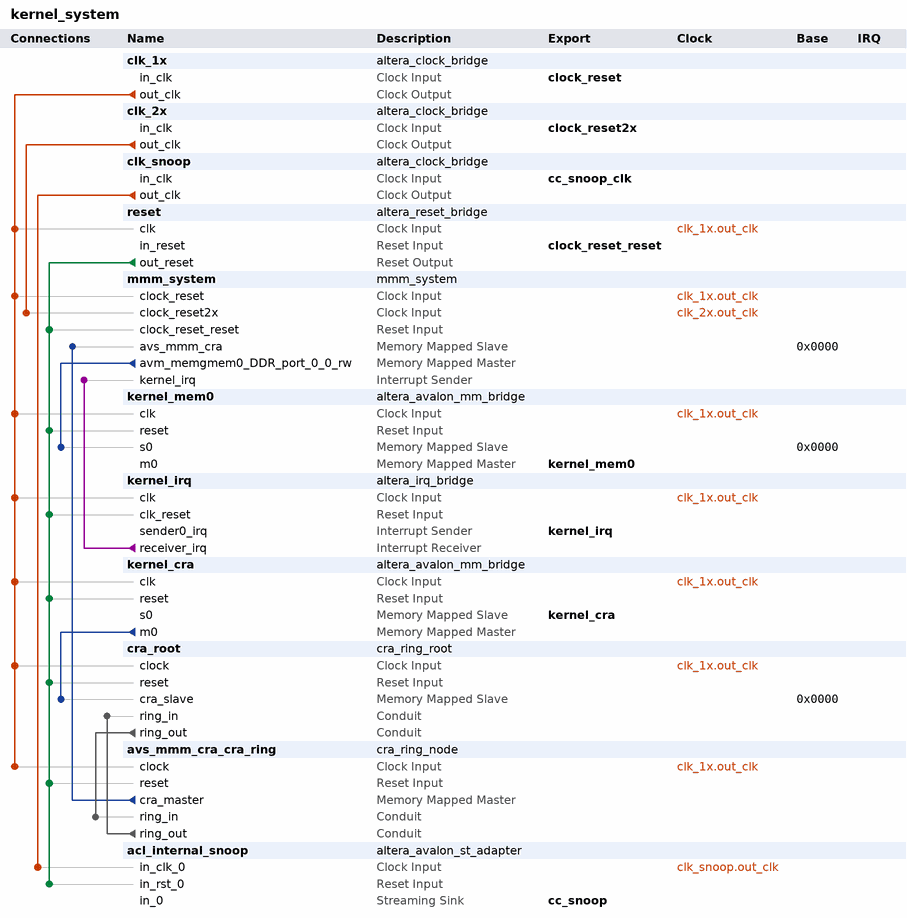
[diagram p0: system contents]
# Platform Designer (Qsys) system kernel_system, Arria 10 10AX115S2F45I1SG
# Parameters at their usual value, and those the tool derives, are not listed.
package require -exact qsys 1.0
create_system kernel_system
set_project_property DEVICE_FAMILY {Arria 10}
set_project_property DEVICE 10AX115S2F45I1SG

add_component clk_1x ip/kernel_system/kernel_system_clk_1x.ip altera_clock_bridge clk_1x 17.1

add_component clk_2x ip/kernel_system/kernel_system_clk_2x.ip altera_clock_bridge clk_2x 17.1

add_component clk_snoop ip/kernel_system/kernel_system_clk_snoop.ip altera_clock_bridge clk_snoop 17.1

add_component reset ip/kernel_system/kernel_system_reset.ip altera_reset_bridge reset 17.1

add_component mmm_system ip/kernel_system/kernel_system_mmm_system.ip mmm_system mmm_system 14.0

add_component kernel_mem0 ip/kernel_system/kernel_system_kernel_mem0.ip altera_avalon_mm_bridge kernel_mem0 17.1

add_component kernel_irq ip/kernel_system/kernel_system_kernel_irq.ip altera_irq_bridge kernel_irq 17.1

add_component kernel_cra ip/kernel_system/kernel_system_kernel_cra.ip altera_avalon_mm_bridge kernel_cra 17.1

add_component cra_root ip/kernel_system/kernel_system_cra_root.ip cra_ring_root cra_root 1.0

add_component avs_mmm_cra_cra_ring ip/kernel_system/kernel_system_avs_mmm_cra_cra_ring.ip cra_ring_node avs_mmm_cra_cra_ring 1.0

add_component acl_internal_snoop ip/kernel_system/kernel_system_acl_internal_snoop.ip altera_avalon_st_adapter acl_internal_snoop 17.1

# connections
add_connection clk_1x.out_clk avs_mmm_cra_cra_ring.clock clock
add_connection clk_1x.out_clk cra_root.clock clock
add_connection clk_1x.out_clk kernel_cra.clk clock
add_connection clk_1x.out_clk kernel_irq.clk clock
add_connection clk_1x.out_clk kernel_mem0.clk clock
add_connection clk_1x.out_clk mmm_system.clock_reset clock
add_connection clk_1x.out_clk reset.clk clock
add_connection clk_2x.out_clk mmm_system.clock_reset2x clock
add_connection clk_snoop.out_clk acl_internal_snoop.in_clk_0 clock
add_connection reset.out_reset acl_internal_snoop.in_rst_0 reset
add_connection reset.out_reset avs_mmm_cra_cra_ring.reset reset
add_connection reset.out_reset cra_root.reset reset
add_connection reset.out_reset kernel_cra.reset reset
add_connection reset.out_reset kernel_irq.clk_reset reset
add_connection reset.out_reset kernel_mem0.reset reset
add_connection reset.out_reset mmm_system.clock_reset_reset reset
add_connection avs_mmm_cra_cra_ring.cra_master mmm_system.avs_mmm_cra avalon
set_connection_parameter_value avs_mmm_cra_cra_ring.cra_master/mmm_system.avs_mmm_cra baseAddress 0x0000
add_connection kernel_cra.m0 cra_root.cra_slave avalon
set_connection_parameter_value kernel_cra.m0/cra_root.cra_slave baseAddress 0x0000
add_connection mmm_system.avm_memgmem0_DDR_port_0_0_rw kernel_mem0.s0 avalon
set_connection_parameter_value mmm_system.avm_memgmem0_DDR_port_0_0_rw/kernel_mem0.s0 baseAddress 0x0000
add_connection avs_mmm_cra_cra_ring.ring_out cra_root.ring_in conduit
add_connection cra_root.ring_out avs_mmm_cra_cra_ring.ring_in conduit
add_connection kernel_irq.receiver_irq mmm_system.kernel_irq interrupt

# exported interfaces
add_interface cc_snoop avalon_streaming sink
set_interface_property cc_snoop EXPORT_OF acl_internal_snoop.in_0
add_interface cc_snoop_clk clock sink
set_interface_property cc_snoop_clk EXPORT_OF clk_snoop.in_clk
add_interface clock_reset clock sink
set_interface_property clock_reset EXPORT_OF clk_1x.in_clk
add_interface clock_reset2x clock sink
set_interface_property clock_reset2x EXPORT_OF clk_2x.in_clk
add_interface clock_reset_reset reset sink
set_interface_property clock_reset_reset EXPORT_OF reset.in_reset
add_interface kernel_cra avalon slave
set_interface_property kernel_cra EXPORT_OF kernel_cra.s0
add_interface kernel_irq interrupt sender
set_interface_property kernel_irq EXPORT_OF kernel_irq.sender0_irq
add_interface kernel_mem0 avalon master
set_interface_property kernel_mem0 EXPORT_OF kernel_mem0.m0

set_interconnect_requirement {$system} qsys_mm.clockCrossingAdapter HANDSHAKE
set_interconnect_requirement {$system} qsys_mm.maxAdditionalLatency 0

save_system kernel_system.qsys
